# Altium project Hardware.PrjPcb
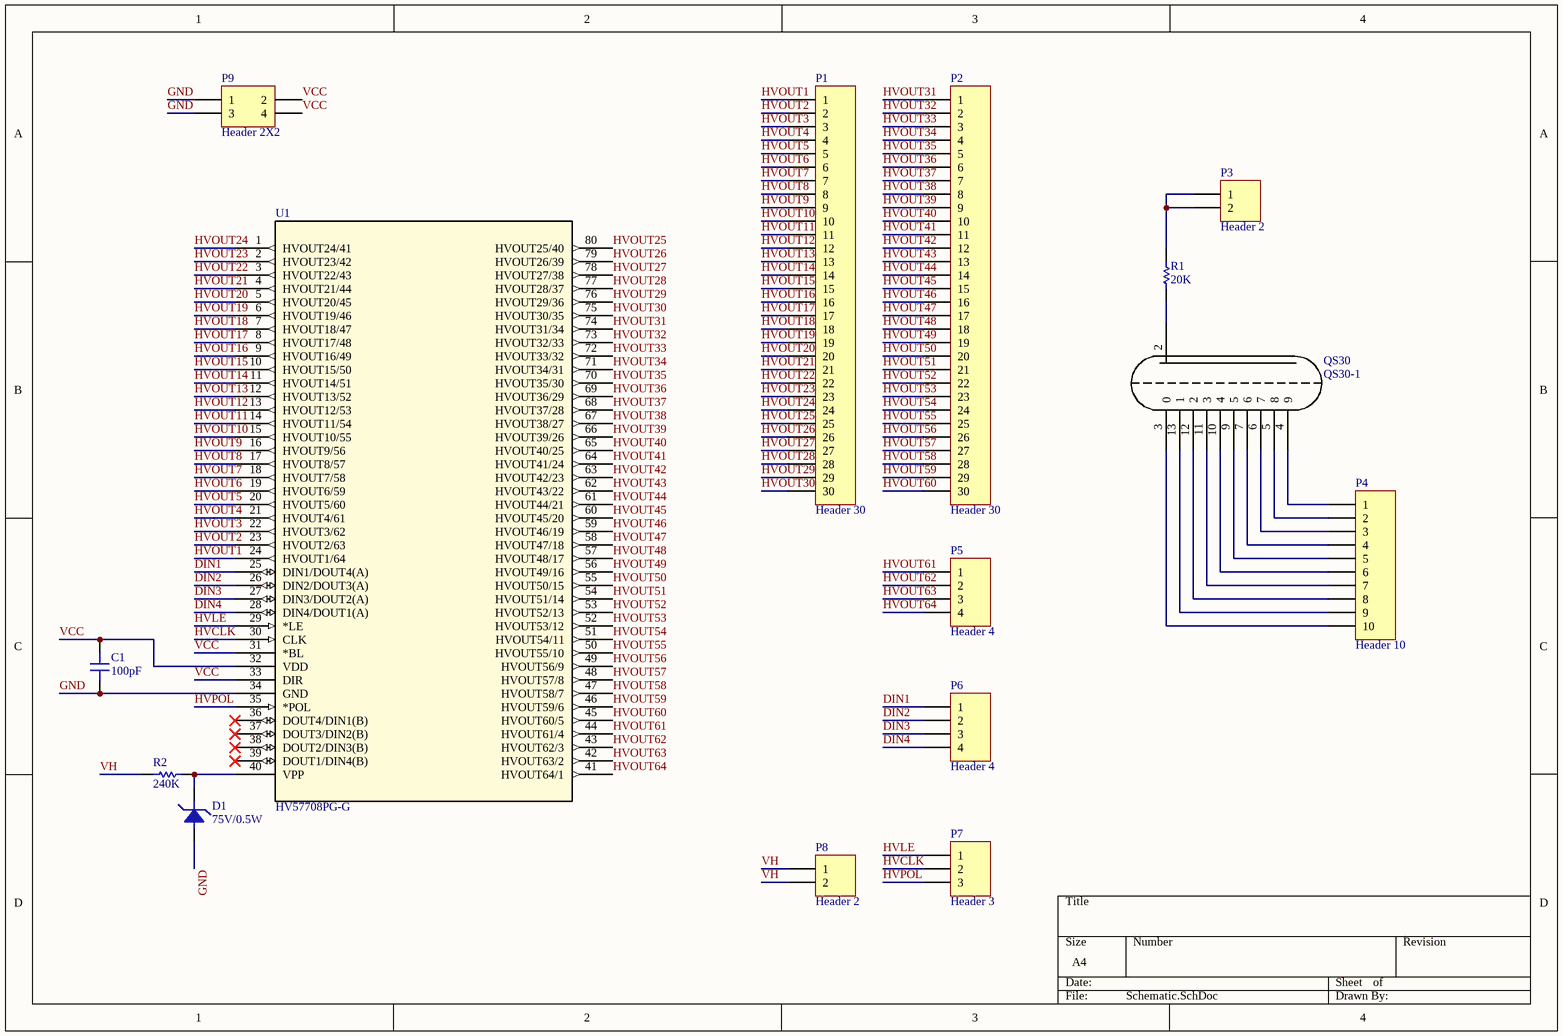
[diagram p0: Schematic.SchDoc]
1 sheet, 15 parts. Net scope: global (net labels, ports and power ports of the same name join across sheets).
Board file: PCB.PcbDoc

## Sheet Schematic.SchDoc
size A4

### Parts
C1  100pF  [0805]
D1  75V/0.5W  [1206 Semiconductor]
P1  Header 30  [HDR1X30]
P2  Header 30  [HDR1X30]
P3  Header 2  [HDR1X2]
P4  Header 10  [HDR1X10]
P5  Header 4  [HDR1X4]
P6  Header 4  [HDR1X4]
P7  Header 3  [HDR1X3]
P8  Header 2  [HDR1X2]
P9  Header 2X2  [HDR2X2]
QS30  QS30-1  [QS30-1]
R1  20K  [0805]
R2  240K  [0805]
U1  HV57708PG-G  [PQFP80_20X14MC_MCH]

### Nets
DIN1: P6.1 U1.25(DIN1/DOUT4(A))
DIN2: P6.2 U1.26(DIN2/DOUT3(A))
DIN3: P6.3 U1.27(DIN3/DOUT2(A))
DIN4: P6.4 U1.28(DIN4/DOUT1(A))
GND: C1.1 D1.2 P9.1 P9.3 U1.34(GND)
HVCLK: P7.2 U1.30(CLK)
HVLE: P7.1 U1.29(*LE)
HVOUT1: P1.1 U1.24(HVOUT1/64)
HVOUT2: P1.2 U1.23(HVOUT2/63)
HVOUT3: P1.3 U1.22(HVOUT3/62)
HVOUT4: P1.4 U1.21(HVOUT4/61)
HVOUT5: P1.5 U1.20(HVOUT5/60)
HVOUT6: P1.6 U1.19(HVOUT6/59)
HVOUT7: P1.7 U1.18(HVOUT7/58)
HVOUT8: P1.8 U1.17(HVOUT8/57)
HVOUT9: P1.9 U1.16(HVOUT9/56)
HVOUT10: P1.10 U1.15(HVOUT10/55)
HVOUT11: P1.11 U1.14(HVOUT11/54)
HVOUT12: P1.12 U1.13(HVOUT12/53)
HVOUT13: P1.13 U1.12(HVOUT13/52)
HVOUT14: P1.14 U1.11(HVOUT14/51)
HVOUT15: P1.15 U1.10(HVOUT15/50)
HVOUT16: P1.16 U1.9(HVOUT16/49)
HVOUT17: P1.17 U1.8(HVOUT17/48)
HVOUT18: P1.18 U1.7(HVOUT18/47)
HVOUT19: P1.19 U1.6(HVOUT19/46)
HVOUT20: P1.20 U1.5(HVOUT20/45)
HVOUT21: P1.21 U1.4(HVOUT21/44)
HVOUT22: P1.22 U1.3(HVOUT22/43)
HVOUT23: P1.23 U1.2(HVOUT23/42)
HVOUT24: P1.24 U1.1(HVOUT24/41)
HVOUT25: P1.25 U1.80(HVOUT25/40)
HVOUT26: P1.26 U1.79(HVOUT26/39)
HVOUT27: P1.27 U1.78(HVOUT27/38)
HVOUT28: P1.28 U1.77(HVOUT28/37)
HVOUT29: P1.29 U1.76(HVOUT29/36)
HVOUT30: P1.30 U1.75(HVOUT30/35)
HVOUT31: P2.1 U1.74(HVOUT31/34)
HVOUT32: P2.2 U1.73(HVOUT32/33)
HVOUT33: P2.3 U1.72(HVOUT33/32)
HVOUT34: P2.4 U1.71(HVOUT34/31)
HVOUT35: P2.5 U1.70(HVOUT35/30)
HVOUT36: P2.6 U1.69(HVOUT36/29)
HVOUT37: P2.7 U1.68(HVOUT37/28)
HVOUT38: P2.8 U1.67(HVOUT38/27)
HVOUT39: P2.9 U1.66(HVOUT39/26)
HVOUT40: P2.10 U1.65(HVOUT40/25)
HVOUT41: P2.11 U1.64(HVOUT41/24)
HVOUT42: P2.12 U1.63(HVOUT42/23)
HVOUT43: P2.13 U1.62(HVOUT43/22)
HVOUT44: P2.14 U1.61(HVOUT44/21)
HVOUT45: P2.15 U1.60(HVOUT45/20)
HVOUT46: P2.16 U1.59(HVOUT46/19)
HVOUT47: P2.17 U1.58(HVOUT47/18)
HVOUT48: P2.18 U1.57(HVOUT48/17)
HVOUT49: P2.19 U1.56(HVOUT49/16)
HVOUT50: P2.20 U1.55(HVOUT50/15)
HVOUT51: P2.21 U1.54(HVOUT51/14)
HVOUT52: P2.22 U1.53(HVOUT52/13)
HVOUT53: P2.23 U1.52(HVOUT53/12)
HVOUT54: P2.24 U1.51(HVOUT54/11)
HVOUT55: P2.25 U1.50(HVOUT55/10)
HVOUT56: P2.26 U1.49(HVOUT56/9)
HVOUT57: P2.27 U1.48(HVOUT57/8)
HVOUT58: P2.28 U1.47(HVOUT58/7)
HVOUT59: P2.29 U1.46(HVOUT59/6)
HVOUT60: P2.30 U1.45(HVOUT60/5)
HVOUT61: P5.1 U1.44(HVOUT61/4)
HVOUT62: P5.2 U1.43(HVOUT62/3)
HVOUT63: P5.3 U1.42(HVOUT63/2)
HVOUT64: P5.4 U1.41(HVOUT64/1)
HVPOL: P7.3 U1.35(*POL)
VCC: C1.2 P9.2 P9.4 U1.31(*BL) U1.32(VDD) U1.33(DIR)
VH: P8.1 P8.2 R2.1
NetD1_1: D1.1 R2.2 U1.40(VPP)
NetP3_1: P3.1 P3.2 R1.1
NetP4_1: P4.1 QS30.4(9)
NetP4_2: P4.2 QS30.5(8)
NetP4_3: P4.3 QS30.6(7)
NetP4_4: P4.4 QS30.7(6)
NetP4_5: P4.5 QS30.9(5)
NetP4_6: P4.6 QS30.10(4)
NetP4_7: P4.7 QS30.11(3)
NetP4_8: P4.8 QS30.12(2)
NetP4_9: P4.9 QS30.13(1)
NetP4_10: P4.10 QS30.3(0)
NetQS30_2: QS30.2 R1.2

Not connected (* = marked no-connect by the designer): U1 36(DOUT4/DIN1(B))* 37(DOUT3/DIN2(B))* 38(DOUT2/DIN3(B))* 39(DOUT1/DIN4(B))*

### Library data of the parts
C1 = Capacitor
D1 = DiodeZener
P1 P2 = Header 30: Header, 30-Pin; LatestRevisionDate: 17-Jul-2002; LatestRevisionNote: Re-released for DXP Platform.; Publisher: Altium Limited
P3 P8 = Header 2: Header, 2-Pin; LatestRevisionDate: 17-Jul-2002; LatestRevisionNote: Re-released for DXP Platform.; Publisher: Altium Limited
P4 = Header 10: Header, 10-Pin; LatestRevisionDate: 17-Jul-2002; LatestRevisionNote: Re-released for DXP Platform.; Publisher: Altium Limited
P5 P6 = Header 4: Header, 4-Pin; LatestRevisionDate: 17-Jul-2002; LatestRevisionNote: Re-released for DXP Platform.; Publisher: Altium Limited
P7 = Header 3: Header, 3-Pin; LatestRevisionDate: 17-Jul-2002; LatestRevisionNote: Re-released for DXP Platform.; Publisher: Altium Limited
P9 = Header 2X2: Header, 2-Pin, Dual row; LatestRevisionDate: 17-Jul-2002; LatestRevisionNote: Re-released for DXP Platform.; Publisher: Altium Limited
R1 R2 = Resistor
U1 = HV57708PG-G: No Description Available; Mfr_Name: Microchip; RefDes: RefDes; Type: Type